# Altium schematic sheet Daughter Board.SchDoc
size A
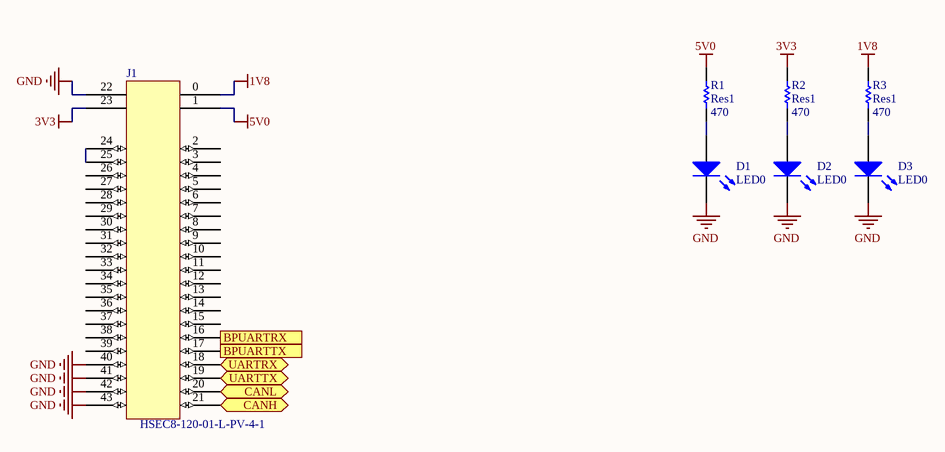
[diagram p0: Daughter Board.SchDoc]

## Parts
D1  LED0  [1608[0603]]
D2  LED0  [1608[0603]]
D3  LED0  [1608[0603]]
J1  HSEC8-120-01-L-PV-4-1  [HSEC8-120-01-L-PV-4-1 Gold Fingers]
R1  Res1  value 470  [1608[0603]]
R2  Res1  value 470  [1608[0603]]
R3  Res1  value 470  [1608[0603]]

## Ports
BPUARTRX (out), BPUARTTX (in), CANH (bidir), CANL (bidir), UARTRX (bidir), UARTTX (bidir)

## Nets
1V8: J1.0 R3.2
3V3: J1.23 R2.2
5V0: J1.1 R1.2
GND: D1.2(K) D2.2(K) D3.2(K) J1.22 J1.40 J1.41 J1.42 J1.43
BPUARTRX: J1.16 ; port BPUARTRX
BPUARTTX: J1.17 ; port BPUARTTX
CANH: J1.21 ; port CANH
CANL: J1.20 ; port CANL
UARTRX: J1.18 ; port UARTRX
UARTTX: J1.19 ; port UARTTX
NetD1_1: D1.1(A) R1.1
NetD2_1: D2.1(A) R2.1
NetD3_1: D3.1(A) R3.1
NetJ1_24: J1.24 J1.25

Not connected (* = marked no-connect by the designer): J1 2(0) 3(0) 4(0) 5(0) 6(0) 7(0) 8(0) 9(0) 10(0) 11(0) 12(0) 13(0) 14(0) 15(0) 26 27 28 29 30 31 32 33 34 35 36 37 38 39

## Library data of the parts
R1-R3 = Res1: Resistor; Published: 8-Jun-2000; LatestRevisionDate: 17-Jul-2002; LatestRevisionNote: Re-released for DXP Platform.; PackageReference: AXIAL-0.3; Publisher: Altium Limited; PackageDescription: Axial Device, Thru-Hole; 2 Leads; 0.3 in Pin Spacing
D1-D3 = LED0: Published: 8-Jun-2000; LatestRevisionDate: 08-Jul-2005; LatestRevisionNote: Mech Layer 1 removed.; PackageReference: LED-0; Publisher: Altium Limited; PackageDescription: LED; 2 Leads
J1 = HSEC8-120-01-L-PV-4-1: Supplier 1: Mouser